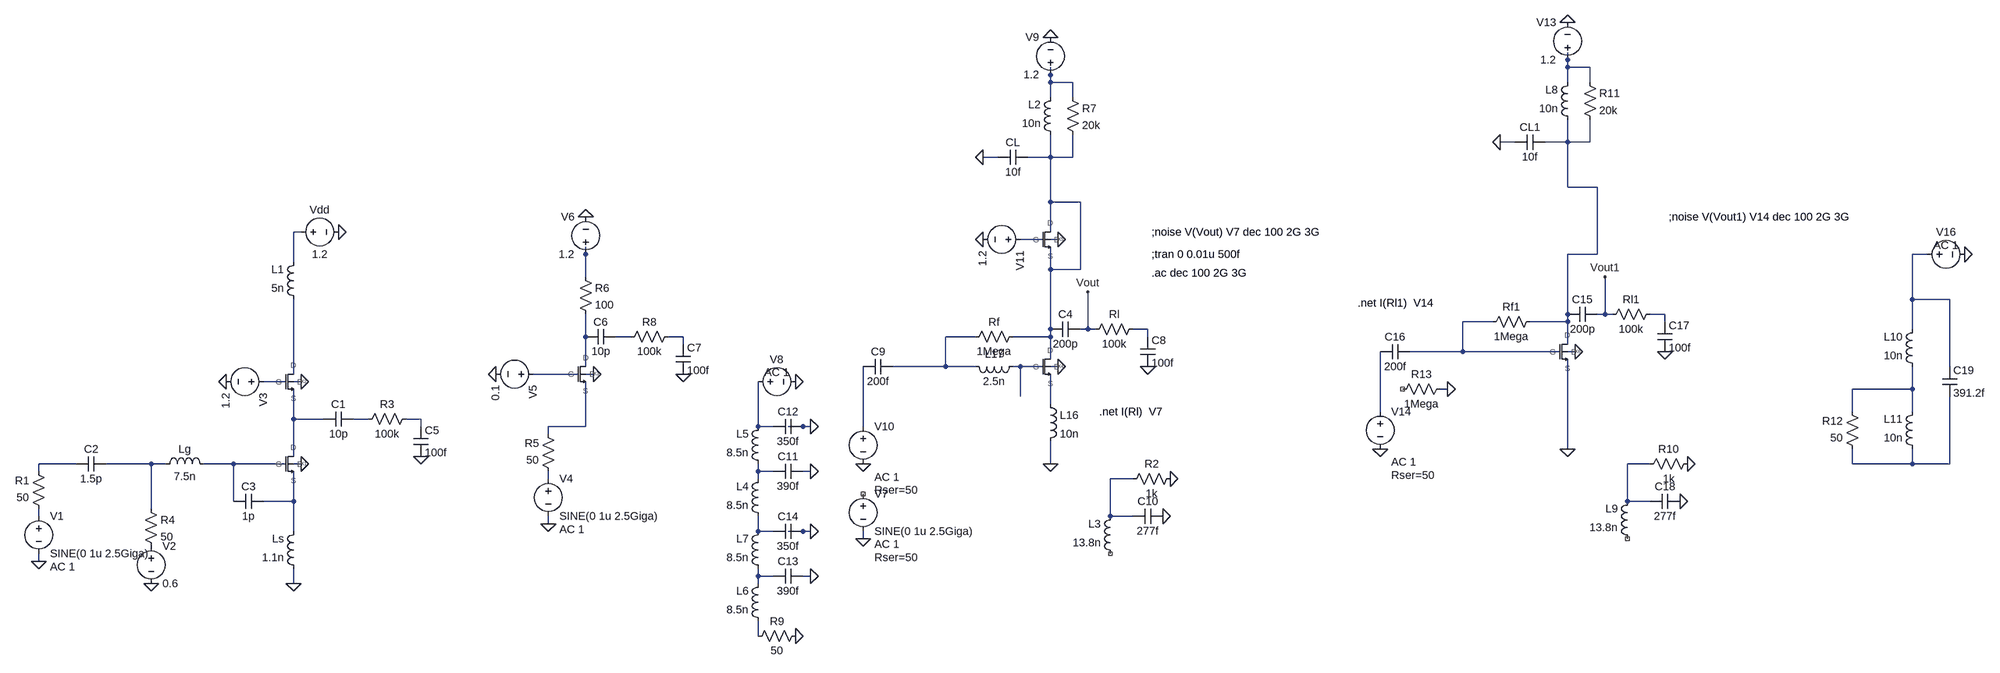
[diagram p0: schematic LNA.asc]
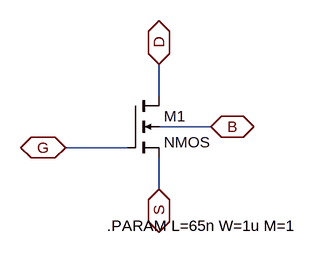
[diagram p1: sub-circuit nmos65.asc]
LNA.asc, the LTspice schematic file:
Version 4
SHEET 1 3812 768
WIRE 2912 -704 2912 -720
WIRE 2912 -688 2912 -704
WIRE 2960 -688 2912 -688
WIRE 1808 -672 1808 -688
WIRE 1808 -656 1808 -672
WIRE 1856 -656 1808 -656
WIRE 2912 -656 2912 -688
WIRE 2960 -656 2960 -688
WIRE 1808 -624 1808 -656
WIRE 1856 -624 1856 -656
WIRE 2800 -528 2768 -528
WIRE 2912 -528 2912 -576
WIRE 2912 -528 2864 -528
WIRE 2960 -528 2960 -576
WIRE 2960 -528 2912 -528
WIRE 1696 -496 1664 -496
WIRE 1808 -496 1808 -544
WIRE 1808 -496 1760 -496
WIRE 1856 -496 1856 -544
WIRE 1856 -496 1808 -496
WIRE 2912 -432 2912 -528
WIRE 2976 -432 2912 -432
WIRE 1808 -400 1808 -496
WIRE 1872 -400 1808 -400
WIRE 208 -336 192 -336
WIRE 1808 -336 1808 -400
WIRE 1792 -320 1744 -320
WIRE 1824 -320 1808 -320
WIRE 816 -288 816 -304
WIRE 2976 -288 2976 -432
WIRE 2976 -288 2912 -288
WIRE 3680 -288 3648 -288
WIRE 192 -272 192 -336
WIRE 1808 -256 1808 -304
WIRE 1872 -256 1872 -400
WIRE 1872 -256 1808 -256
WIRE 816 -240 816 -288
WIRE 3648 -192 3648 -288
WIRE 3728 -192 3648 -192
WIRE 2912 -160 2912 -288
WIRE 2992 -160 2992 -240
WIRE 2992 -160 2976 -160
WIRE 3008 -160 2992 -160
WIRE 3120 -160 3088 -160
WIRE 2752 -144 2688 -144
WIRE 2912 -144 2912 -160
WIRE 2912 -144 2832 -144
WIRE 3120 -144 3120 -160
WIRE 1808 -128 1808 -256
WIRE 1888 -128 1888 -208
WIRE 1888 -128 1872 -128
WIRE 1904 -128 1888 -128
WIRE 2016 -128 1984 -128
WIRE 3648 -128 3648 -192
WIRE 816 -112 816 -160
WIRE 912 -112 880 -112
WIRE 1024 -112 992 -112
WIRE 1648 -112 1584 -112
WIRE 1808 -112 1808 -128
WIRE 1808 -112 1728 -112
WIRE 2016 -112 2016 -128
WIRE 1024 -96 1024 -112
WIRE 2912 -96 2912 -144
WIRE 2688 -80 2688 -144
WIRE 2688 -80 2576 -80
WIRE 2896 -80 2688 -80
WIRE 2928 -80 2912 -80
WIRE 1808 -64 1808 -112
WIRE 816 -48 816 -112
WIRE 1584 -48 1584 -112
WIRE 1584 -48 1472 -48
WIRE 1648 -48 1584 -48
WIRE 1744 -48 1728 -48
WIRE 1792 -48 1744 -48
WIRE 1824 -48 1808 -48
WIRE 3728 -48 3728 -192
WIRE 192 -32 192 -192
WIRE 800 -32 704 -32
WIRE 832 -32 816 -32
WIRE 176 -16 128 -16
WIRE 208 -16 192 -16
WIRE 2656 0 2640 0
WIRE 3648 0 3648 -48
WIRE 3648 0 3520 0
WIRE 1744 16 1744 -48
WIRE 1808 32 1808 -32
WIRE 2512 48 2512 -80
WIRE 3520 48 3520 0
WIRE 3648 48 3648 0
WIRE 192 64 192 0
WIRE 256 64 192 64
WIRE 352 64 320 64
WIRE 464 64 432 64
WIRE 464 80 464 64
WIRE 816 80 816 -16
WIRE 816 80 736 80
WIRE 1184 80 1184 -16
WIRE 1216 80 1184 80
WIRE 1280 80 1248 80
WIRE 1296 80 1280 80
WIRE 1408 80 1408 -48
WIRE 736 96 736 80
WIRE 2912 128 2912 -64
WIRE 192 144 192 64
WIRE -272 160 -352 160
WIRE -112 160 -208 160
WIRE -80 160 -112 160
WIRE 64 160 0 160
WIRE 176 160 64 160
WIRE 208 160 192 160
WIRE 1808 160 1808 112
WIRE 3088 160 3040 160
WIRE 3520 160 3520 128
WIRE 3648 160 3648 128
WIRE 3648 160 3520 160
WIRE 3728 160 3728 16
WIRE 3728 160 3648 160
WIRE -352 176 -352 160
WIRE 1184 176 1184 160
WIRE 1216 176 1184 176
WIRE 1296 176 1280 176
WIRE 736 192 736 176
WIRE 1184 192 1184 176
WIRE 1984 192 1936 192
WIRE 64 240 64 160
WIRE 192 240 192 176
WIRE 192 240 128 240
WIRE 3040 240 3040 160
WIRE 3088 240 3040 240
WIRE -112 256 -112 160
WIRE -352 272 -352 256
WIRE 1936 272 1936 192
WIRE 1984 272 1936 272
WIRE 736 288 736 272
WIRE 192 304 192 240
WIRE 1184 304 1184 272
WIRE 1216 304 1184 304
WIRE 1280 304 1248 304
WIRE 1296 304 1280 304
WIRE 1408 320 1408 304
WIRE -352 368 -352 352
WIRE 1184 400 1184 384
WIRE 1216 400 1184 400
WIRE 1296 400 1280 400
WIRE 192 416 192 384
WIRE 1184 416 1184 400
WIRE 1184 528 1184 496
FLAG -352 368 0
FLAG 288 -336 0
FLAG 192 416 0
FLAG 208 160 0
FLAG 208 -16 0
FLAG -112 416 0
FLAG 48 -16 0
FLAG 832 -32 0
FLAG 736 288 0
FLAG 624 -32 0
FLAG 816 -368 0
FLAG 464 144 0
FLAG 1024 -32 0
FLAG 1824 -48 0
FLAG 1408 320 0
FLAG 1808 -752 0
FLAG 1808 160 0
FLAG 1888 -208 Vout
FLAG 1664 -496 0
FLAG 2016 -48 0
FLAG 2064 192 0
FLAG 2048 272 0
FLAG 1296 80 0
FLAG 1296 176 0
FLAG 1264 -16 0
FLAG 1408 160 0
FLAG 1824 -320 0
FLAG 1664 -320 0
FLAG 1296 304 0
FLAG 1296 400 0
FLAG 1264 528 0
FLAG 2928 -80 0
FLAG 2912 -784 0
FLAG 2912 128 0
FLAG 2992 -240 Vout1
FLAG 2768 -528 0
FLAG 3120 -80 0
FLAG 3168 160 0
FLAG 3152 240 0
FLAG 2512 128 0
FLAG 3760 -288 0
FLAG 2656 0 0
SYMBOL nmos65 208 160 R0
WINDOW 0 0 0 Left 0
SYMATTR InstName X1
SYMATTR Value L=65nm, W=10um, M=22
SYMBOL res -336 272 R180
WINDOW 0 36 76 Left 2
WINDOW 3 36 40 Left 2
SYMATTR InstName R1
SYMATTR Value 50
SYMBOL voltage -352 256 R0
WINDOW 123 24 124 Left 2
WINDOW 39 0 0 Left 0
SYMATTR Value2 AC 1
SYMATTR InstName V1
SYMATTR Value SINE(0 1u 2.5Giga)
SYMBOL voltage 192 -336 R270
WINDOW 0 32 56 VTop 2
WINDOW 3 -32 56 VBottom 2
WINDOW 123 0 0 Left 0
WINDOW 39 0 0 Left 0
SYMATTR InstName Vdd
SYMATTR Value 1.2
SYMBOL cap -208 144 R90
WINDOW 0 0 32 VBottom 2
WINDOW 3 32 32 VTop 2
SYMATTR InstName C2
SYMATTR Value 1.5p
SYMBOL ind 208 400 R180
WINDOW 0 36 80 Left 2
WINDOW 3 36 40 Left 2
SYMATTR InstName Ls
SYMATTR Value 1.1n
SYMATTR SpiceLine Rser=1.57k
SYMBOL ind -96 176 R270
WINDOW 0 32 56 VTop 2
WINDOW 3 5 56 VBottom 2
SYMATTR InstName Lg
SYMATTR Value 7.5n
SYMATTR SpiceLine Rser=1.57k
SYMBOL res -128 240 R0
SYMATTR InstName R4
SYMATTR Value 50
SYMBOL nmos65 208 -16 R0
WINDOW 0 0 0 Left 0
SYMATTR InstName X2
SYMATTR Value L=65nm, W=10um,M=22
SYMBOL voltage -112 320 R0
WINDOW 123 0 0 Left 0
WINDOW 39 0 0 Left 0
SYMATTR InstName V2
SYMATTR Value 0.6
SYMBOL voltage 144 -16 R90
WINDOW 123 0 0 Left 0
WINDOW 39 0 0 Left 0
SYMATTR InstName V3
SYMATTR Value 1.2
SYMBOL cap 128 224 R90
WINDOW 0 0 32 VBottom 2
WINDOW 3 32 32 VTop 2
SYMATTR InstName C3
SYMATTR Value 1p
SYMBOL nmos65 832 -32 R0
WINDOW 0 0 0 Left 0
SYMATTR InstName X3
SYMATTR Value L=65nm, W=10um, M=22
SYMBOL res 752 192 R180
WINDOW 0 36 76 Left 2
WINDOW 3 36 40 Left 2
SYMATTR InstName R5
SYMATTR Value 50
SYMBOL voltage 736 176 R0
WINDOW 123 24 124 Left 2
WINDOW 39 0 0 Left 0
SYMATTR Value2 AC 1
SYMATTR InstName V4
SYMATTR Value SINE(0 1u 2.5Giga)
SYMBOL res 800 -256 R0
SYMATTR InstName R6
SYMATTR Value 100
SYMBOL voltage 720 -32 R90
WINDOW 123 0 0 Left 0
WINDOW 39 0 0 Left 0
SYMATTR InstName V5
SYMATTR Value 0.1
SYMBOL voltage 816 -272 R180
WINDOW 0 24 96 Left 2
WINDOW 3 24 16 Left 2
WINDOW 123 0 0 Left 0
WINDOW 39 0 0 Left 0
SYMATTR InstName V6
SYMATTR Value 1.2
SYMBOL cap 320 48 R90
WINDOW 0 0 32 VBottom 2
WINDOW 3 32 32 VTop 2
SYMATTR InstName C1
SYMATTR Value 10p
SYMBOL res 448 48 R90
WINDOW 0 0 56 VBottom 2
WINDOW 3 32 56 VTop 2
SYMATTR InstName R3
SYMATTR Value 100k
SYMBOL cap 448 80 R0
SYMATTR InstName C5
SYMATTR Value 100f
SYMBOL cap 880 -128 R90
WINDOW 0 0 32 VBottom 2
WINDOW 3 32 32 VTop 2
SYMATTR InstName C6
SYMATTR Value 10p
SYMBOL res 1008 -128 R90
WINDOW 0 0 56 VBottom 2
WINDOW 3 32 56 VTop 2
SYMATTR InstName R8
SYMATTR Value 100k
SYMBOL cap 1008 -96 R0
SYMATTR InstName C7
SYMATTR Value 100f
SYMBOL ind 208 -176 R180
WINDOW 0 36 80 Left 2
WINDOW 3 36 40 Left 2
SYMATTR InstName L1
SYMATTR Value 5n
SYMATTR SpiceLine Rser=1.57k
SYMBOL nmos65 1824 -48 R0
WINDOW 0 0 0 Left 0
SYMATTR InstName X4
SYMATTR Value L=65nm, W=100um, M=10
SYMBOL voltage 1408 208 R0
WINDOW 123 24 124 Left 2
WINDOW 39 24 152 Left 2
SYMATTR Value2 AC 1
SYMATTR SpiceLine Rser=50
SYMATTR InstName V7
SYMATTR Value SINE(0 1u 2.5Giga)
SYMBOL voltage 1808 -656 R180
WINDOW 0 24 96 Left 2
WINDOW 3 24 16 Left 2
WINDOW 123 0 0 Left 0
WINDOW 39 0 0 Left 0
SYMATTR InstName V9
SYMATTR Value 1.2
SYMBOL cap 1872 -144 R90
WINDOW 0 0 32 VBottom 2
WINDOW 3 32 32 VTop 2
SYMATTR InstName C4
SYMATTR Value 200p
SYMBOL res 2000 -144 R90
WINDOW 0 0 56 VBottom 2
WINDOW 3 32 56 VTop 2
SYMATTR InstName Rl
SYMATTR Value 100k
SYMBOL cap 1472 -64 R90
WINDOW 0 0 32 VBottom 2
WINDOW 3 32 32 VTop 2
SYMATTR InstName C9
SYMATTR Value 200f
SYMBOL res 1744 -128 R90
WINDOW 0 0 56 VBottom 2
WINDOW 3 32 56 VTop 2
SYMATTR InstName Rf
SYMATTR Value 1Mega
SYMBOL ind 1824 -528 R180
WINDOW 0 36 80 Left 2
WINDOW 3 36 40 Left 2
SYMATTR InstName L2
SYMATTR Value 10n
SYMATTR SpiceLine Rser=1.57k
SYMBOL cap 1760 -512 R90
WINDOW 0 0 32 VBottom 2
WINDOW 3 32 32 VTop 2
SYMATTR InstName CL
SYMATTR Value 10f
SYMBOL cap 2000 -112 R0
SYMATTR InstName C8
SYMATTR Value 100f
SYMBOL res 2080 176 R90
WINDOW 0 0 56 VBottom 2
WINDOW 3 32 56 VTop 2
SYMATTR InstName R2
SYMATTR Value 1k
SYMBOL ind 1952 368 R180
WINDOW 0 36 80 Left 2
WINDOW 3 36 40 Left 2
SYMATTR InstName L3
SYMATTR Value 13.8n
SYMBOL cap 2048 256 R90
WINDOW 0 0 32 VBottom 2
WINDOW 3 32 32 VTop 2
SYMATTR InstName C10
SYMATTR Value 277f
SYMBOL ind 1200 288 R180
WINDOW 0 36 80 Left 2
WINDOW 3 36 40 Left 2
SYMATTR InstName L4
SYMATTR Value 8.5n
SYMATTR SpiceLine Rser=1.57k
SYMBOL ind 1200 176 R180
WINDOW 0 36 80 Left 2
WINDOW 3 36 40 Left 2
SYMATTR InstName L5
SYMATTR Value 8.5n
SYMATTR SpiceLine Rser=1.57k
SYMBOL cap 1280 160 R90
WINDOW 0 0 32 VBottom 2
WINDOW 3 32 32 VTop 2
SYMATTR InstName C11
SYMATTR Value 390f
SYMBOL cap 1280 64 R90
WINDOW 0 0 32 VBottom 2
WINDOW 3 32 32 VTop 2
SYMATTR InstName C12
SYMATTR Value 350f
SYMBOL voltage 1168 -16 R270
WINDOW 0 32 56 VTop 2
WINDOW 3 -32 56 VBottom 2
WINDOW 123 4 56 VTop 2
WINDOW 39 0 0 Left 0
SYMATTR InstName V8
SYMATTR Value ""
SYMATTR Value2 AC 1
SYMBOL voltage 1408 64 R0
WINDOW 123 24 124 Left 2
WINDOW 39 24 152 Left 2
SYMATTR InstName V10
SYMATTR Value ""
SYMATTR Value2 AC 1
SYMATTR SpiceLine Rser=50
SYMBOL res 1840 -640 R0
SYMATTR InstName R7
SYMATTR Value 20k
SYMBOL nmos65 1824 -320 R0
WINDOW 0 0 0 Left 0
SYMATTR InstName X5
SYMATTR Value L=65nm, W=10um,M=22
SYMBOL voltage 1760 -320 R90
WINDOW 123 0 0 Left 0
WINDOW 39 0 0 Left 0
SYMATTR InstName V11
SYMATTR Value 1.2
SYMBOL ind 1200 512 R180
WINDOW 0 36 80 Left 2
WINDOW 3 36 40 Left 2
SYMATTR InstName L6
SYMATTR Value 8.5n
SYMATTR SpiceLine Rser=1.57k
SYMBOL ind 1200 400 R180
WINDOW 0 36 80 Left 2
WINDOW 3 36 40 Left 2
SYMATTR InstName L7
SYMATTR Value 8.5n
SYMATTR SpiceLine Rser=1.57k
SYMBOL cap 1280 384 R90
WINDOW 0 0 32 VBottom 2
WINDOW 3 32 32 VTop 2
SYMATTR InstName C13
SYMATTR Value 390f
SYMBOL cap 1280 288 R90
WINDOW 0 0 32 VBottom 2
WINDOW 3 32 32 VTop 2
SYMATTR InstName C14
SYMATTR Value 350f
SYMBOL res 1280 512 R90
WINDOW 0 0 56 VBottom 2
WINDOW 3 32 56 VTop 2
SYMATTR InstName R9
SYMATTR Value 50
SYMBOL nmos65 2928 -80 R0
WINDOW 0 0 0 Left 0
SYMATTR InstName X6
SYMATTR Value L=65nm, W=100um, M=10
SYMBOL voltage 2912 -688 R180
WINDOW 0 24 96 Left 2
WINDOW 3 24 16 Left 2
WINDOW 123 0 0 Left 0
WINDOW 39 0 0 Left 0
SYMATTR InstName V13
SYMATTR Value 1.2
SYMBOL cap 2976 -176 R90
WINDOW 0 0 32 VBottom 2
WINDOW 3 32 32 VTop 2
SYMATTR InstName C15
SYMATTR Value 200p
SYMBOL res 3104 -176 R90
WINDOW 0 0 56 VBottom 2
WINDOW 3 32 56 VTop 2
SYMATTR InstName Rl1
SYMATTR Value 100k
SYMBOL cap 2576 -96 R90
WINDOW 0 0 32 VBottom 2
WINDOW 3 32 32 VTop 2
SYMATTR InstName C16
SYMATTR Value 200f
SYMBOL res 2848 -160 R90
WINDOW 0 0 56 VBottom 2
WINDOW 3 32 56 VTop 2
SYMATTR InstName Rf1
SYMATTR Value 1Mega
SYMBOL ind 2928 -560 R180
WINDOW 0 36 80 Left 2
WINDOW 3 36 40 Left 2
SYMATTR InstName L8
SYMATTR Value 10n
SYMATTR SpiceLine Rser=1.57k
SYMBOL cap 2864 -544 R90
WINDOW 0 0 32 VBottom 2
WINDOW 3 32 32 VTop 2
SYMATTR InstName CL1
SYMATTR Value 10f
SYMBOL cap 3104 -144 R0
SYMATTR InstName C17
SYMATTR Value 100f
SYMBOL res 3184 144 R90
WINDOW 0 0 56 VBottom 2
WINDOW 3 32 56 VTop 2
SYMATTR InstName R10
SYMATTR Value 1k
SYMBOL ind 3056 336 R180
WINDOW 0 36 80 Left 2
WINDOW 3 36 40 Left 2
SYMATTR InstName L9
SYMATTR Value 13.8n
SYMBOL cap 3152 224 R90
WINDOW 0 0 32 VBottom 2
WINDOW 3 32 32 VTop 2
SYMATTR InstName C18
SYMATTR Value 277f
SYMBOL voltage 2512 32 R0
WINDOW 123 24 124 Left 2
WINDOW 39 24 152 Left 2
SYMATTR InstName V14
SYMATTR Value ""
SYMATTR Value2 AC 1
SYMATTR SpiceLine Rser=50
SYMBOL res 2944 -672 R0
SYMATTR InstName R11
SYMATTR Value 20k
SYMBOL voltage 3664 -288 R270
WINDOW 0 32 56 VTop 2
WINDOW 3 -32 56 VBottom 2
WINDOW 123 4 56 VTop 2
WINDOW 39 0 0 Left 0
SYMATTR InstName V16
SYMATTR Value ""
SYMATTR Value2 AC 1
SYMBOL ind 1792 16 R0
SYMATTR InstName L16
SYMATTR Value 10n
SYMBOL ind 1744 -64 R90
WINDOW 0 5 56 VBottom 2
WINDOW 3 32 56 VTop 2
SYMATTR InstName L17
SYMATTR Value 2.5n
SYMBOL ind 3664 -32 R180
WINDOW 0 36 80 Left 2
WINDOW 3 36 40 Left 2
SYMATTR InstName L10
SYMATTR Value 10n
SYMBOL ind 3664 144 R180
WINDOW 0 36 80 Left 2
WINDOW 3 36 40 Left 2
SYMATTR InstName L11
SYMATTR Value 10n
SYMBOL res 3536 144 R180
WINDOW 0 36 76 Left 2
WINDOW 3 36 40 Left 2
SYMATTR InstName R12
SYMATTR Value 50
SYMBOL cap 3712 -48 R0
SYMATTR InstName C19
SYMATTR Value 391.2f
SYMBOL res 2656 -16 R90
WINDOW 0 0 56 VBottom 2
WINDOW 3 32 56 VTop 2
SYMATTR InstName R13
SYMATTR Value 1Mega
TEXT 2024 -248 Left 2 !.ac dec 100 2G 3G
TEXT 2024 -288 Left 2 !;tran 0 0.01u 500f
TEXT 2024 -336 Left 2 !;noise V(Vout) V7 dec 100 2G 3G
TEXT 1912 48 Left 2 !.net I(Rl)  V7
TEXT 3128 -368 Left 2 !;noise V(Vout1) V14 dec 100 2G 3G
TEXT 2464 -184 Left 2 !.net I(Rl1)  V14

nmos65.asc, the sub-circuit schematic file:
Version 4
SHEET 1 880 680
WIRE 160 144 160 96
WIRE 240 192 160 192
WIRE 112 224 16 224
WIRE 160 288 160 240
FLAG 16 224 G
IOPIN 16 224 BiDir
FLAG 160 96 D
IOPIN 160 96 BiDir
FLAG 160 288 S
IOPIN 160 288 BiDir
FLAG 240 192 B
IOPIN 240 192 BiDir
SYMBOL nmos4 112 144 R0
SYMATTR InstName M1
SYMATTR Value2 l={L} w={W} ad='2*65n*{W}' as='2*65n*{W}' pd='2*(2*65n+{W})' ps='2*(2*65n+{W})' m={M}
TEXT 80 344 Left 2 !.PARAM L=65n W=1u M=1

The netlist it stands for:
* LNA.asc
XX1 N031 N023 N037 0 nmos65 params: L=65nm, W=10um, M=22
R1 N038 N029 50
V1 N038 0 SINE(0 1u 2.5Giga) AC 1
Vdd N005 0 1.2
C2 N030 N029 1.5p
Ls 0 N037 1.1n Rser=1.57k
Lg N030 N031 7.5n Rser=1.57k
R4 N030 P001 50
XX2 N019 N017 N023 0 nmos65 params: L=65nm, W=10um,M=22
V2 P001 0 0.6
V3 N019 0 1.2
C3 N037 N031 1p
XX3 N018 N012 N026 0 nmos65 params: L=65nm, W=10um, M=22
R5 N035 N026 50
V4 N035 0 SINE(0 1u 2.5Giga) AC 1
R6 N007 N012 100
V5 N018 0 0.1
V6 N007 0 1.2
C1 N024 N023 10p
R3 N025 N024 100k
C5 N025 0 100f
C6 N013 N012 10p
R8 N014 N013 100k
C7 N014 0 100f
L1 N017 N005 5n Rser=1.57k
XX4 N016 N004 N021 0 nmos65 params: L=65nm, W=100um, M=10
V7 NC_01 0 SINE(0 1u 2.5Giga) AC 1 Rser=50
V9 N002 0 1.2
C4 Vout N004 200p
Rl N011 Vout 100k
C9 N015 N028 200f
Rf N004 N015 1Mega
L2 N004 N002 10n Rser=1.57k
CL N004 0 10f
C8 N011 0 100f
R2 0 N036 1k
L3 NC_02 N036 13.8n
C10 0 N036 277f
L4 N039 N034 8.5n Rser=1.57k
L5 N034 N027 8.5n Rser=1.57k
C11 0 N034 390f
C12 0 N027 350f
V8 N027 0 AC 1
V10 N028 0 AC 1 Rser=50
R7 N002 N004 20k
XX5 N006 N004 N004 0 nmos65 params: L=65nm, W=10um,M=22
V11 N006 0 1.2
L6 N041 N040 8.5n Rser=1.57k
L7 N040 N039 8.5n Rser=1.57k
C13 0 N040 390f
C14 0 N039 350f
R9 0 N041 50
XX6 N010 N003 0 0 nmos65 params: L=65nm, W=100um, M=10
V13 N001 0 1.2
C15 Vout1 N003 200p
Rl1 N009 Vout1 100k
C16 N010 N022 200f
Rf1 N003 N010 1Mega
L8 N003 N001 10n Rser=1.57k
CL1 N003 0 10f
C17 N009 0 100f
R10 0 N032 1k
L9 NC_03 N032 13.8n
C18 0 N032 277f
V14 N022 0 AC 1 Rser=50
R11 N001 N003 20k
V16 N008 0 AC 1
L16 N021 0 10n
L17 N016 N015 2.5n
L10 N020 N008 10n
L11 N033 N020 10n
R12 N033 N020 50
C19 N008 N033 391.2f
R13 0 NC_04 1Mega

* block symbol definitions
.subckt nmos65 G D S B
M1 D G S B NMOS l={L} w={W} ad='2*65n*{W}' as='2*65n*{W}' pd='2*(2*65n+{W})' ps='2*(2*65n+{W})' m={M}
.PARAM L=65n W=1u M=1
.ends nmos65

.model NMOS NMOS
.model PMOS PMOS
.lib standard.mos
.ac dec 100 2G 3G
;tran 0 0.01u 500f
;noise V(Vout) V7 dec 100 2G 3G
.net I(Rl)  V7
;noise V(Vout1) V14 dec 100 2G 3G
.net I(Rl1)  V14
.backanno
.end